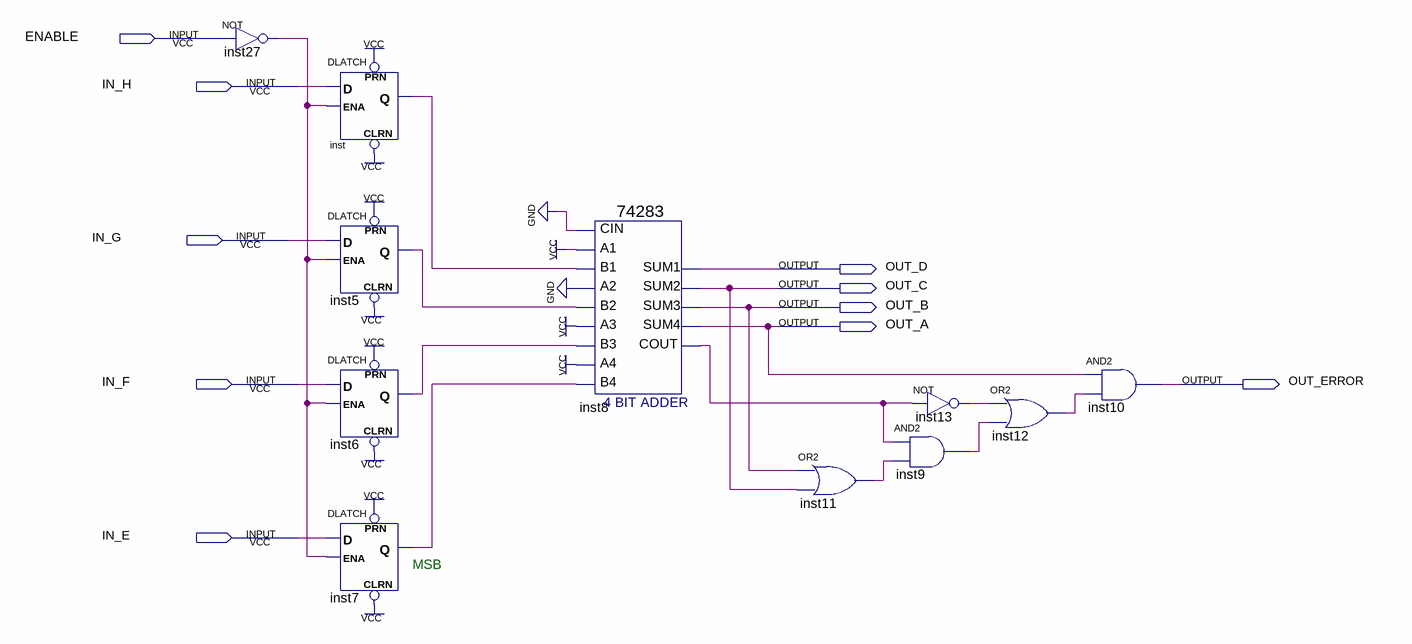
[diagram p0: schematic sheet]
// Quartus schematic DS_LAB_EX7_Q1.bdf as structural Verilog: 11 symbols, 10 pins
module DS_LAB_EX7_Q1 (
  input  ENABLE,
  input  IN_H,
  input  IN_G,
  input  IN_F,
  input  IN_E,
  output OUT_D,
  output OUT_C,
  output OUT_B,
  output OUT_A,
  output OUT_ERROR
);

  wire inst5_q, inst6_q, inst7_q, inst8_cout, inst9_out, inst11_out, inst12_out, inst13_out, inst27_out,
       inst_q;

  not inst27 (inst27_out, ENABLE);
  DLATCH inst (.CLRN(1'b1), .D(IN_H), .ENA(inst27_out), .PRN(1'b1), .Q(inst_q));
  DLATCH inst5 (.CLRN(1'b1), .D(IN_G), .ENA(inst27_out), .PRN(1'b1), .Q(inst5_q));
  DLATCH inst6 (.CLRN(1'b1), .D(IN_F), .ENA(inst27_out), .PRN(1'b1), .Q(inst6_q));
  DLATCH inst7 (.CLRN(1'b1), .D(IN_E), .ENA(inst27_out), .PRN(1'b1), .Q(inst7_q));
  \74283  inst8 (
    .CIN(1'b0), .A1(1'b1), .A2(1'b0), .B2(inst5_q), .A3(1'b1), .A4(1'b1), .B4(inst7_q), .B1(inst_q),
    .B3(inst6_q), .SUM4(OUT_A), .COUT(inst8_cout), .SUM1(OUT_D), .SUM2(OUT_C), .SUM3(OUT_B));
  or inst11 (inst11_out, OUT_B, OUT_C);
  not inst13 (inst13_out, inst8_cout);
  and inst9 (inst9_out, inst8_cout, inst11_out);
  or inst12 (inst12_out, inst13_out, inst9_out);
  and inst10 (OUT_ERROR, OUT_A, inst12_out);

  // Notes on the sheet:
  //   MSB
endmodule
